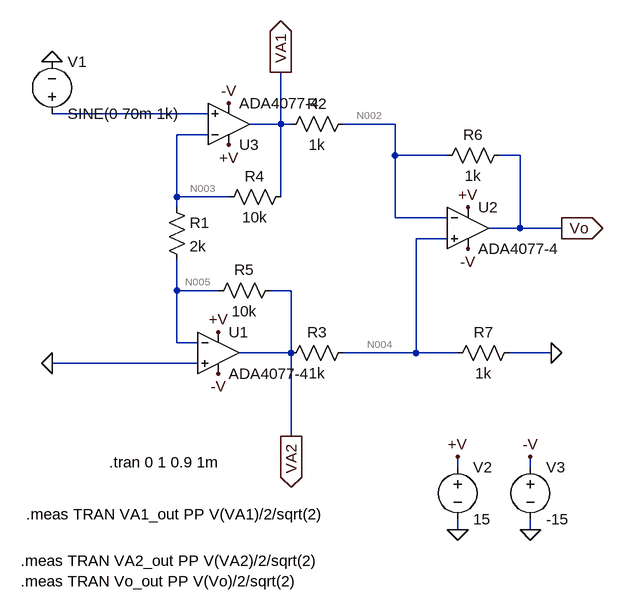
[diagram p0: schematic InstrumentationAmplifierCircuit_single_sin_input.asc]
InstrumentationAmplifierCircuit_single_sin_input.asc, the LTspice schematic file:
Version 4.1
SHEET 1 936 748
WIRE 304 16 64 16
WIRE 416 32 416 -48
WIRE 416 32 368 32
WIRE 432 32 416 32
WIRE 592 32 512 32
WIRE 304 48 256 48
WIRE 592 80 592 32
WIRE 672 80 592 80
WIRE 784 80 752 80
WIRE 256 144 256 48
WIRE 336 144 256 144
WIRE 416 144 416 32
WIRE 256 160 256 144
WIRE 592 176 592 80
WIRE 672 176 592 176
WIRE 784 192 784 80
WIRE 784 192 736 192
WIRE 848 192 784 192
WIRE 672 208 624 208
WIRE 256 288 256 240
WIRE 320 288 256 288
WIRE 432 288 400 288
WIRE 256 368 256 288
WIRE 288 368 256 368
WIRE 432 384 432 288
WIRE 432 384 352 384
WIRE 624 384 624 208
WIRE 624 384 512 384
WIRE 688 384 624 384
WIRE 832 384 768 384
WIRE 288 400 64 400
WIRE 432 512 432 384
WIRE 688 560 688 544
WIRE 800 560 800 544
WIRE 688 656 688 640
WIRE 800 656 800 640
FLAG 336 64 +V
FLAG 336 0 -V
FLAG 320 352 +V
FLAG 320 416 -V
FLAG 704 160 +V
FLAG 704 224 -V
FLAG 848 192 Vo
IOPIN 848 192 Out
FLAG 832 384 0
FLAG 416 -48 VA1
IOPIN 416 -48 Out
FLAG 432 512 VA2
IOPIN 432 512 Out
FLAG 64 400 0
FLAG 64 -64 0
FLAG 688 544 +V
FLAG 688 656 0
FLAG 800 544 -V
FLAG 800 656 0
SYMBOL res 240 144 R0
SYMATTR InstName R1
SYMATTR Value 2k
SYMBOL res 528 16 R90
WINDOW 0 0 56 VBottom 2
WINDOW 3 32 56 VTop 2
SYMATTR InstName R2
SYMATTR Value 1k
SYMBOL res 528 368 R90
WINDOW 0 0 56 VBottom 2
WINDOW 3 32 56 VTop 2
SYMATTR InstName R3
SYMATTR Value 1k
SYMBOL res 432 128 R90
WINDOW 0 0 56 VBottom 2
WINDOW 3 32 56 VTop 2
SYMATTR InstName R4
SYMATTR Value 10k
SYMBOL res 416 272 R90
WINDOW 0 0 56 VBottom 2
WINDOW 3 32 56 VTop 2
SYMATTR InstName R5
SYMATTR Value 10k
SYMBOL res 768 64 R90
WINDOW 0 0 56 VBottom 2
WINDOW 3 32 56 VTop 2
SYMATTR InstName R6
SYMATTR Value 1k
SYMBOL res 784 368 R90
WINDOW 0 0 56 VBottom 2
WINDOW 3 32 56 VTop 2
SYMATTR InstName R7
SYMATTR Value 1k
SYMBOL OpAmps\\ADA4077-4 320 320 R0
SYMATTR InstName U1
SYMBOL OpAmps\\ADA4077-4 704 128 R0
SYMATTR InstName U2
SYMBOL OpAmps\\ADA4077-4 336 96 M180
SYMATTR InstName U3
SYMBOL voltage 64 32 M180
WINDOW 0 24 96 Left 2
WINDOW 3 24 16 Left 2
WINDOW 123 0 0 Left 0
WINDOW 39 0 0 Left 0
SYMATTR InstName V1
SYMATTR Value SINE(0 70m 1k)
SYMBOL voltage 688 544 R0
WINDOW 123 0 0 Left 2
WINDOW 39 0 0 Left 2
SYMATTR InstName V2
SYMATTR Value 15
SYMBOL voltage 800 544 R0
WINDOW 123 24 146 Left 2
WINDOW 39 24 125 Left 2
SYMATTR InstName V3
SYMATTR Value -15
TEXT 152 552 Left 2 !.tran 0 1 0.9 1m
TEXT 24 632 Left 2 !.meas TRAN VA1_out PP V(VA1)/2/sqrt(2)
TEXT 16 704 Left 2 !.meas TRAN VA2_out PP V(VA2)/2/sqrt(2)\n.meas TRAN Vo_out PP V(Vo)/2/sqrt(2)

The netlist it stands for:
* InstrumentationAmplifierCircuit_single_sin_input.asc
R1 N003 N005 2k
R2 N002 VA1 1k
R3 N004 VA2 1k
R4 VA1 N003 10k
R5 VA2 N005 10k
R6 Vo N002 1k
R7 0 N004 1k
X§U1 0 N005 +V -V VA2 ADA4077-4  ; pins In+ In- V+ V- OUT
X§U2 N004 N002 +V -V Vo ADA4077-4  ; pins In+ In- V+ V- OUT
X§U3 N001 N003 +V -V VA1 ADA4077-4  ; pins In+ In- V+ V- OUT
V1 N001 0 SINE(0 70m 1k)
V2 +V 0 15
V3 -V 0 -15
.tran 0 1 0.9 1m
.meas TRAN VA1_out PP V(VA1)/2/sqrt(2)
.meas TRAN VA2_out PP V(VA2)/2/sqrt(2)
.meas TRAN Vo_out PP V(Vo)/2/sqrt(2)
.backanno
.end

* Results of the author's LTspice run, read from the files saved beside the schematic
* Operating Point, zero values left out:
*   V(n005) = 10.15 µV
*   V(va1) = 5.165 µV
*   V(n004) = 2.783 µV
*   V(vo) = 20.21 µV
*   V(n003) = 10.15 µV
*   V(n002) = 12.94 µV
*   V(va2) = 5.165 µV
*   V(+v) = 15 V
*   V(-v) = -15 V
*   I(R3) = -2.382 nA
*   I(R5) = -498.9 pA
*   I(R6) = 7.273 nA
*   I(V1) = 401.1 pA
*   I(R2) = 7.772 nA
*   I(R4) = -498.9 pA
*   I(R7) = -2.783 nA
*   I(V2) = -1.2 mA
*   I(V3) = 1.2 mA
*   Ix(u2:1) = -401.1 pA
*   Ix(u2:2) = -498.9 pA
*   Ix(u2:3) = 400 µA
*   Ix(u2:4) = -400 µA
*   Ix(u2:5) = -7.273 nA
*   Ix(u1:1) = -401.1 pA
*   Ix(u1:2) = -498.9 pA
*   Ix(u1:3) = 400 µA
*   Ix(u1:4) = -400 µA
*   Ix(u1:5) = -1.883 nA
*   Ix(u3:1) = -401.1 pA
*   Ix(u3:2) = -498.9 pA
*   Ix(u3:3) = 400 µA
*   Ix(u3:4) = -400 µA
*   Ix(u3:5) = 8.27 nA
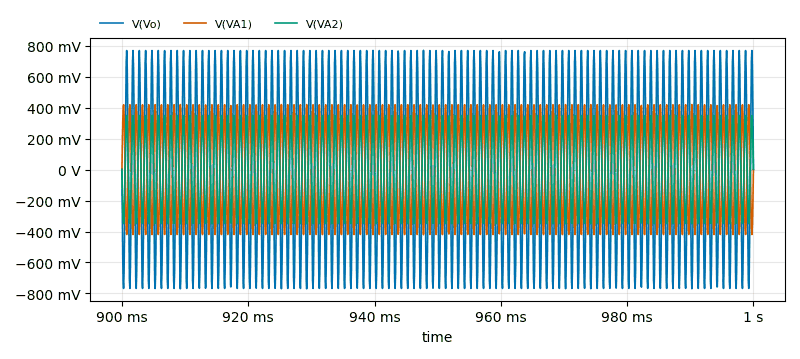
[diagram p1: Transient Analysis of InstrumentationAmplifierCircuit_single_sin_input.asc, plotted from the saved traces]
* Transient Analysis, 1 run:
*   V(Vo): min -770 mV, max 770 mV, average -561.4 µV, rms 539.8 mV, last 2.71 mV
*   V(VA1): min -420 mV, max 420 mV, average 322.4 µV, rms 294.4 mV, last -1.145 mV
*   V(VA2): min -350 mV, max 350 mV, average -259.2 µV, rms 245.4 mV, last 1.144 mV
* From the log:
*   va1_out: PP(V(VA1)/2/sqrt(2))=0.296978021573 FROM 0 TO 0.1
*   va2_out: PP(V(VA2)/2/sqrt(2))=0.247480720535 FROM 0 TO 0.1
*   vo_out: PP(V(Vo)/2/sqrt(2))=0.544457498777 FROM 0 TO 0.1